# EAGLE design psu (EAGLE 7.4.0)
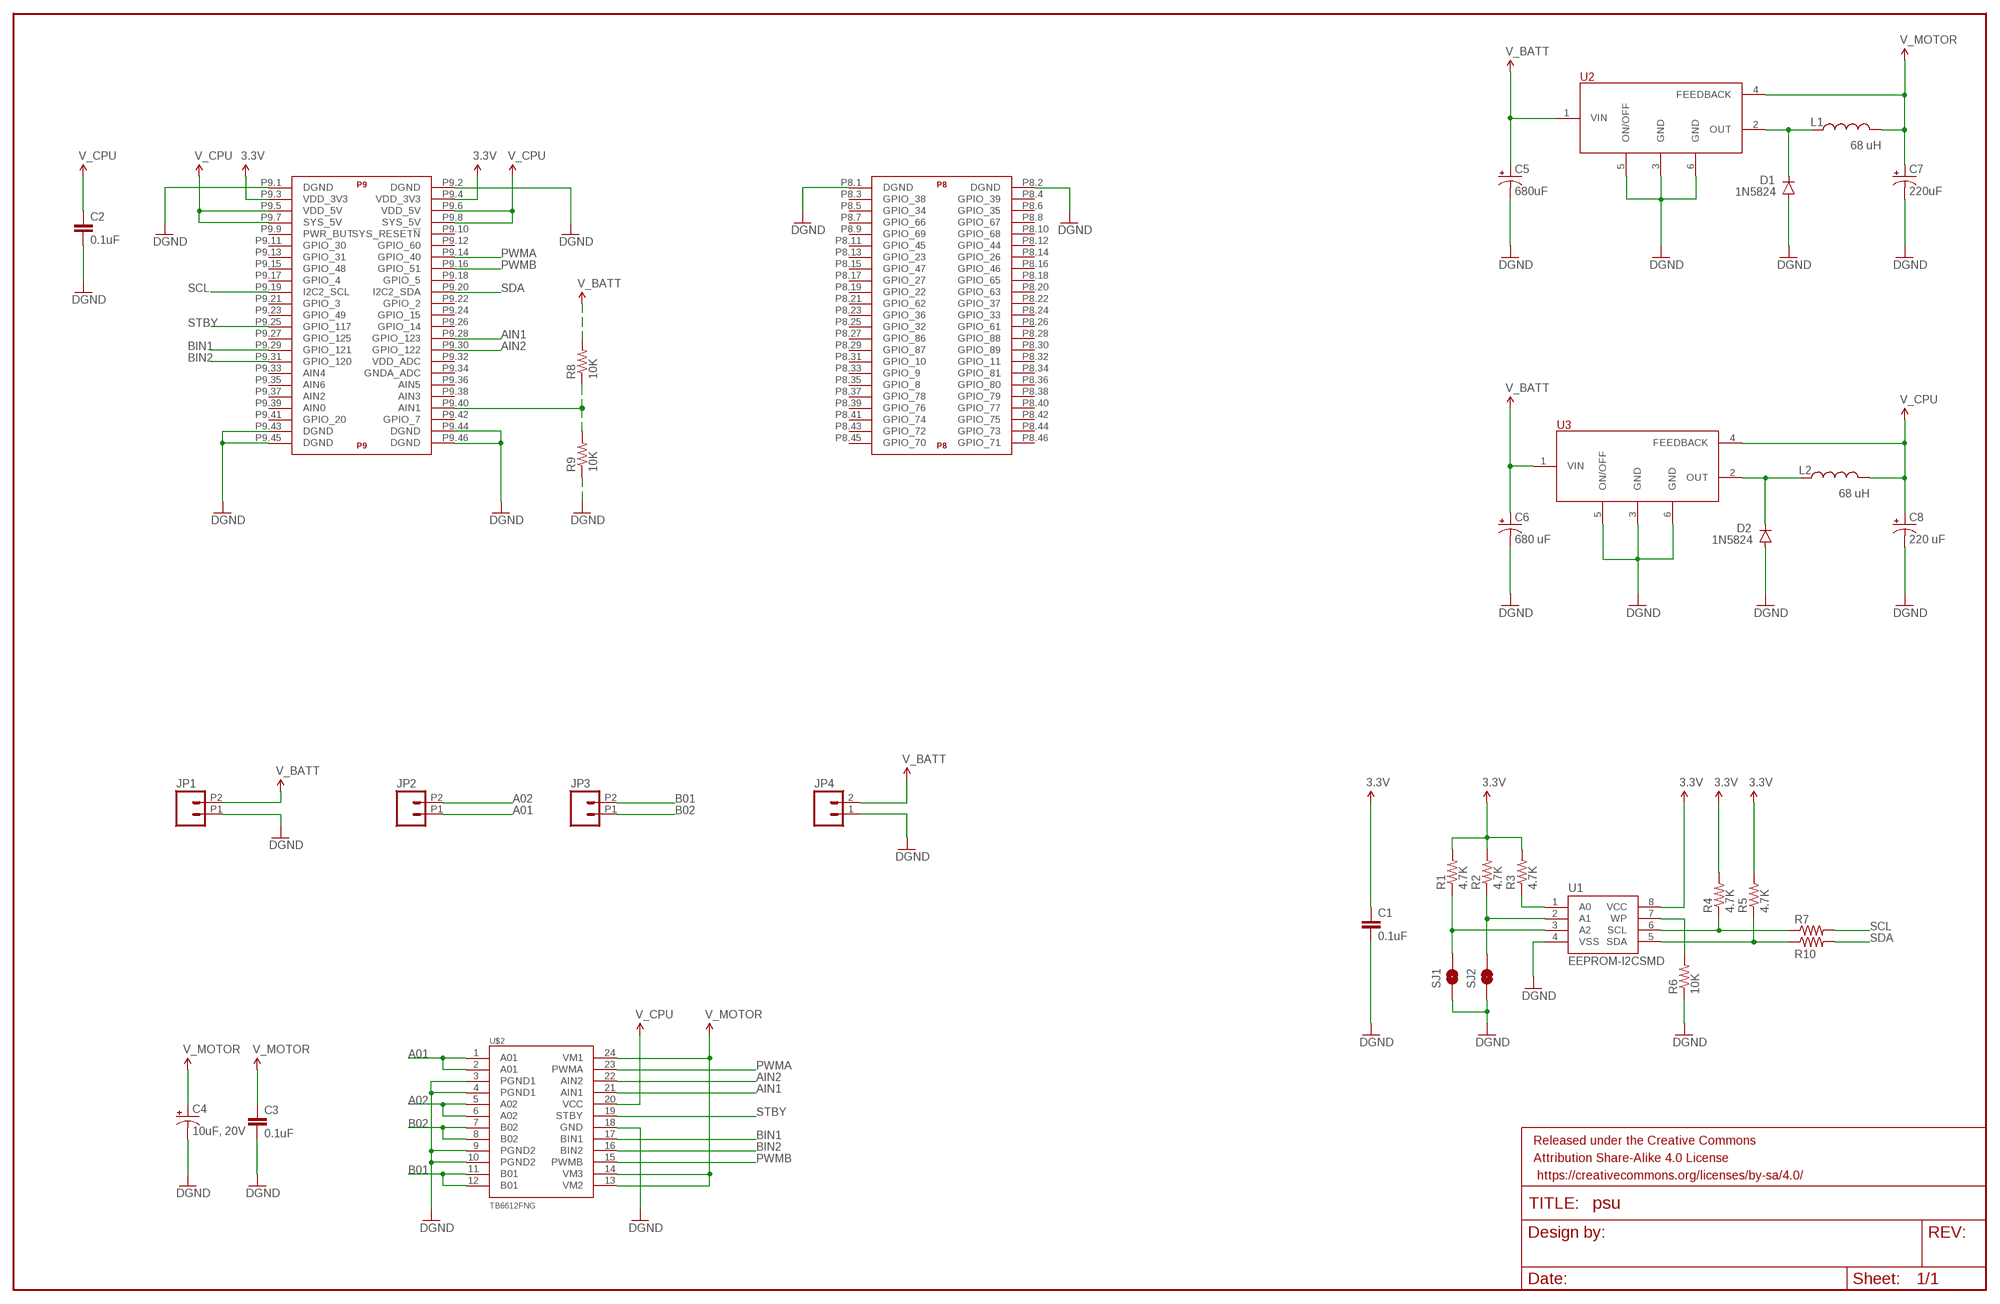
[diagram p0: schematic, sheet 1]

## Parts
C1  0.1uF  0.1UF-25V(+80/-20%)(0603)  [0603-CAP]
C2  0.1uF  0.1UF-25V(+80/-20%)(0603)  [0603-CAP]
C3  0.1uF  0.1UF-25V(+80/-20%)(0603)  [0603-CAP]
C4  10uF, 20V  10UF-25V-20%(PTH)KIT  [CPOL-RADIAL-10UF-25V-KIT]
C5  680uF  CAP_POLPTH2  [CPOL-RADIAL-10UF-25V]
C6  680 uF  CAP_POLPTH2  [CPOL-RADIAL-10UF-25V]
C7  220uF  CAP_POLPTH2  [CPOL-RADIAL-10UF-25V]
C8  220 uF  CAP_POLPTH2  [CPOL-RADIAL-10UF-25V]
D1  1N5824  DIODEPTH  [DIODE-1N4001]
D2  1N5824  DIODEPTH  [DIODE-1N4001]
FRAME2  FRAME-LEDGER  [CREATIVE_COMMONS]
JP1  M022.54MM_SCREWTERM  [1X02_2.54_SCREWTERM]
JP2  M022.54MM_SCREWTERM  [1X02_2.54_SCREWTERM]
JP3  M022.54MM_SCREWTERM  [1X02_2.54_SCREWTERM]
JP4  M023.5MM  [SCREWTERMINAL-3.5MM-2]
L1  68 uH  INDUCTOR0603  [0603]
L2  68 uH  INDUCTOR0603  [0603]
R1  4.7K  4.7KOHM-1/10W-1%(0603)  [0603-RES]
R2  4.7K  4.7KOHM-1/10W-1%(0603)  [0603-RES]
R3  4.7K  4.7KOHM-1/10W-1%(0603)  [0603-RES]
R4  4.7K  4.7KOHM-1/10W-1%(0603)  [0603-RES]
R5  4.7K  4.7KOHM-1/10W-1%(0603)  [0603-RES]
R6  10K  10KOHM-1/10W-1%(0603)0603  [0603-RES]
R7  0  RESISTOR0603  [0603-RES]
R8  10K  10KOHM-1/10W-1%(0603)0603  [0603-RES]
R9  10K  10KOHM-1/10W-1%(0603)0603  [0603-RES]
R10  0  RESISTOR0603  [0603-RES]
SJ1  JUMPER-PAD-2-NO  [PAD-JUMPER-2-NO_NO_SILK]
SJ2  JUMPER-PAD-2-NO  [PAD-JUMPER-2-NO_NO_SILK]
U1  EEPROM-I2CSMD  [SO08]
U2  LM2596  [TO-263]
U3  LM2596  [TO-263]
U$1  BEAGLE_BONE_BLACK_CAPE  [BEAGLE_BONE_BLACK_CAPE]
U$2  TB6612FNG  [SSOP24]

## Nets
3.3V: C1.1 R1.2 R2.2 R3.2 R4.2 R5.2 U1.8(VCC) U$1.P9.3(P9:VDD_3V3) U$1.P9.4(P9:VDD_3V3)
A01: JP2.P1 U$2.1(A01) U$2.2(A01)
A02: JP2.P2 U$2.5(A02) U$2.6(A02)
AIN1: U$1.P9.28(P9:GPIO_123) U$2.21(AIN1)
AIN2: U$1.P9.30(P9:GPIO_122) U$2.22(AIN2)
B01: JP3.P2 U$2.11(B01) U$2.12(B01)
B02: JP3.P1 U$2.7(B02) U$2.8(B02)
BIN1: U$1.P9.29(P9:GPIO_121) U$2.17(BIN1)
BIN2: U$1.P9.31(P9:GPIO_120) U$2.16(BIN2)
GND: C1.2 C2.2 C3.2 C4.2(-) C5.2(-) C6.2(-) C7.2(-) C8.2(-) D1.A D2.A JP1.P1 JP4.1 R6.1 R9.1 SJ1.1 SJ2.1 U1.4(VSS) U2.3(GND) U2.5(ON/OFF) U2.6(GND) U3.3(GND) U3.5(ON/OFF) U3.6(GND) U$1.P8.1(P8:DGND) U$1.P8.2(P8:DGND) U$1.P9.1(P9:DGND) U$1.P9.2(P9:DGND) U$1.P9.43(P9:DGND) U$1.P9.44(P9:DGND) U$1.P9.45(P9:DGND) U$1.P9.46(P9:DGND) U$2.3(PGND1) U$2.4(PGND1) U$2.9(PGND2) U$2.10(PGND2) U$2.18(GND) ; supply symbol labelled DGND
N$1: R3.1 U1.1(A0)
N$2: R2.1 SJ2.2 U1.2(A1)
N$3: R1.1 SJ1.2 U1.3(A2)
N$4: R8.1 R9.2 U$1.P9.40(P9:AIN1)
N$5: R6.2 U1.7(WP)
N$8: D1.C L1.1 U2.2(OUT)
N$9: D2.C L2.1 U3.2(OUT)
PWMA: U$1.P9.14(P9:GPIO_40) U$2.23(PWMA)
PWMB: U$1.P9.16(P9:GPIO_51) U$2.15(PWMB)
SCL: R7.2 U$1.P9.19(P9:I2C2_SCL)
SCL_PRE: R4.1 R7.1 U1.6(SCL)
SDA: R10.2 U$1.P9.20(P9:I2C2_SDA)
SDA_PRE: R5.1 R10.1 U1.5(SDA)
STBY: U$1.P9.25(P9:GPIO_117) U$2.19(STBY)
V_BATT: C5.1(+) C6.1(+) JP1.P2 JP4.2 R8.2 U2.1(VIN) U3.1(VIN)
V_CPU: C2.1 C8.1(+) L2.2 U3.4(FEEDBACK) U$1.P9.5(P9:VDD_5V) U$1.P9.6(P9:VDD_5V) U$1.P9.7(P9:SYS_5V) U$1.P9.8(P9:SYS_5V) U$2.20(VCC)
V_MOTOR: C3.1 C4.1(+) C7.1(+) L1.2 U2.4(FEEDBACK) U$2.13(VM2) U$2.14(VM3) U$2.24(VM1)
Unconnected: U$1.P8.3(P8:GPIO_38) U$1.P8.4(P8:GPIO_39) U$1.P8.5(P8:GPIO_34) U$1.P8.6(P8:GPIO_35) U$1.P8.7(P8:GPIO_66) U$1.P8.8(P8:GPIO_67) U$1.P8.9(P8:GPIO_69) U$1.P8.10(P8:GPIO_68) U$1.P8.11(P8:GPIO_45) U$1.P8.12(P8:GPIO_44) U$1.P8.13(P8:GPIO_23) U$1.P8.14(P8:GPIO_26) U$1.P8.15(P8:GPIO_47) U$1.P8.16(P8:GPIO_46) U$1.P8.17(P8:GPIO_27) U$1.P8.18(P8:GPIO_65) U$1.P8.19(P8:GPIO_22) U$1.P8.20(P8:GPIO_63) U$1.P8.21(P8:GPIO_62) U$1.P8.22(P8:GPIO_37) U$1.P8.23(P8:GPIO_36) U$1.P8.24(P8:GPIO_33) U$1.P8.25(P8:GPIO_32) U$1.P8.26(P8:GPIO_61) U$1.P8.27(P8:GPIO_86) U$1.P8.28(P8:GPIO_88) U$1.P8.29(P8:GPIO_87) U$1.P8.30(P8:GPIO_89) U$1.P8.31(P8:GPIO_10) U$1.P8.32(P8:GPIO_11) U$1.P8.33(P8:GPIO_9) U$1.P8.34(P8:GPIO_81) U$1.P8.35(P8:GPIO_8) U$1.P8.36(P8:GPIO_80) U$1.P8.37(P8:GPIO_78) U$1.P8.38(P8:GPIO_79) U$1.P8.39(P8:GPIO_76) U$1.P8.40(P8:GPIO_77) U$1.P8.41(P8:GPIO_74) U$1.P8.42(P8:GPIO_75) U$1.P8.43(P8:GPIO_72) U$1.P8.44(P8:GPIO_73) U$1.P8.45(P8:GPIO_70) U$1.P8.46(P8:GPIO_71) U$1.P9.9(P9:PWR_BUT) U$1.P9.10(P9:SYS_RESET!N) U$1.P9.11(P9:GPIO_30) U$1.P9.12(P9:GPIO_60) U$1.P9.13(P9:GPIO_31) U$1.P9.15(P9:GPIO_48) U$1.P9.17(P9:GPIO_4) U$1.P9.18(P9:GPIO_5) U$1.P9.21(P9:GPIO_3) U$1.P9.22(P9:GPIO_2) U$1.P9.23(P9:GPIO_49) U$1.P9.24(P9:GPIO_15) U$1.P9.26(P9:GPIO_14) U$1.P9.27(P9:GPIO_125) U$1.P9.32(P9:VDD_ADC) U$1.P9.33(P9:AIN4) U$1.P9.34(P9:GNDA_ADC) U$1.P9.35(P9:AIN6) U$1.P9.36(P9:AIN5) U$1.P9.37(P9:AIN2) U$1.P9.38(P9:AIN3) U$1.P9.39(P9:AIN0) U$1.P9.41(P9:GPIO_20) U$1.P9.42(P9:GPIO_7)

## Library data of the parts
C1-C3 = SparkFun-Capacitors:0.1UF-25V(+80/-20%)(0603): CAP-00810 Ceramic Standard decoupling cap; PROD_ID: CAP-00810
C4 = SparkFun-Capacitors:10UF-25V-20%(PTH): CAP-08440; PROD_ID: CAP-08440
C5-C8 = SparkFun-Capacitors:CAP_POL: Capacitor Polarized These are standard SMD and PTH capacitors. Normally 10uF, 47uF, and 100uF in electrolytic and tantalum varieties. Always verify the external diameter of the through hole cap, it varies with capacity, voltage, and manufacturer. The EIA devices should be standard.
D1 D2 = SparkFun-DiscreteSemi:DIODE: Diode These are standard reverse protection diodes and small signal diodes. SMA package can handle up to about 1A. SOD-323 can handle about 200mA. What the SOD-323 package when ordering, there are some mfgs out there that are 5-pin packages.
FRAME2 = SparkFun-Aesthetics:FRAME-LEDGER: Schematic Frame Standard 11x14 US Ledger frame
JP1-JP3 = SparkFun-Connectors:M02: Standard 2-pin 0.1" header. Use with - straight break away headers ( PRT-00116) - right angle break away headers (PRT-00553) - swiss pins (PRT-00743) - machine pins (PRT-00117) - female headers (PRT-00115) Molex polarized connector foot print use with: PRT-08233 with associated crimp pins and housings. 2.54_SCREWTERM for use with PRT-10571. 3.5mm Screw Terminal footprints for PRT-08084 5mm Screw Terminal footprints for use with PRT-08432
JP4 = SparkFun-Connectors:M02: Standard 2-pin 0.1" header. Use with - straight break away headers ( PRT-00116) - right angle break away headers (PRT-00553) - swiss pins (PRT-00743) - machine pins (PRT-00117) - female headers (PRT-00115) Molex polarized connector foot print use with: PRT-08233 with associated crimp pins and housings. 2.54_SCREWTERM for use with PRT-10571. 3.5mm Screw Terminal footprints for PRT-08084 5mm Screw Terminal footprints for use with PRT-08432; PROD_ID: CONN-08399
L1 L2 = SparkFun-Passives:INDUCTOR: Inductors Basic Inductor/Choke - 0603 and 1206. Footprints are not proven and vary greatly between part numbers. INDUCTOR POWER 3.3UH 4.0A SMD 0.197" L x 0.197" W x 0.177" H (5.00mm x 5.00mm x 4.50mm)
R1-R5 = SparkFun-Resistors:4.7KOHM-1/10W-1%(0603): RES-07857; PROD_ID: RES-07857
R6 R8 R9 = SparkFun-Resistors:10KOHM-1/10W-1%(0603): RES-00824; PROD_ID: RES-00824
R7 R10 = SparkFun-Resistors:RESISTOR: Resistor Basic schematic elements and footprints for 0603, 1206, and PTH resistors.
SJ1 SJ2 = SparkFun-Passives:JUMPER-PAD-2-NO
U1 = SparkFun-DigitalIC:EEPROM-I2C: I2C EEPROM chips, 24LC256 (and others)
U2 U3 = psu:LM2596: TI Buck converter
U$1 = SparkFun-Boards:BEAGLE_BONE_BLACK_CAPE
U$2 = SparkFun-PowerIC:TB6612FNG: Toshiba 1A dual motor driver IC-09363; PROD_ID: IC-09363

## Board
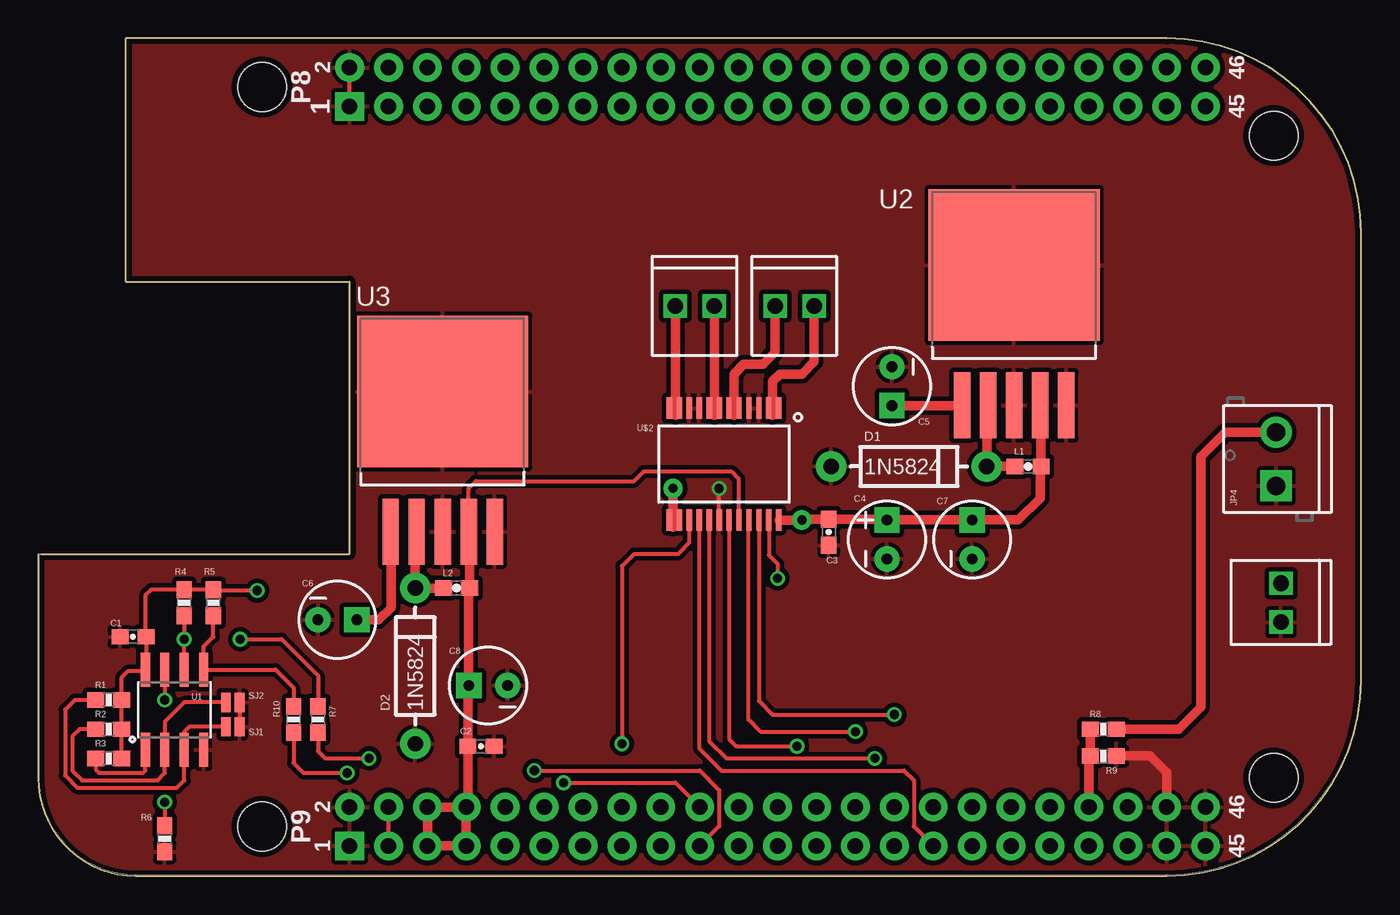
[diagram p1: board, top side]
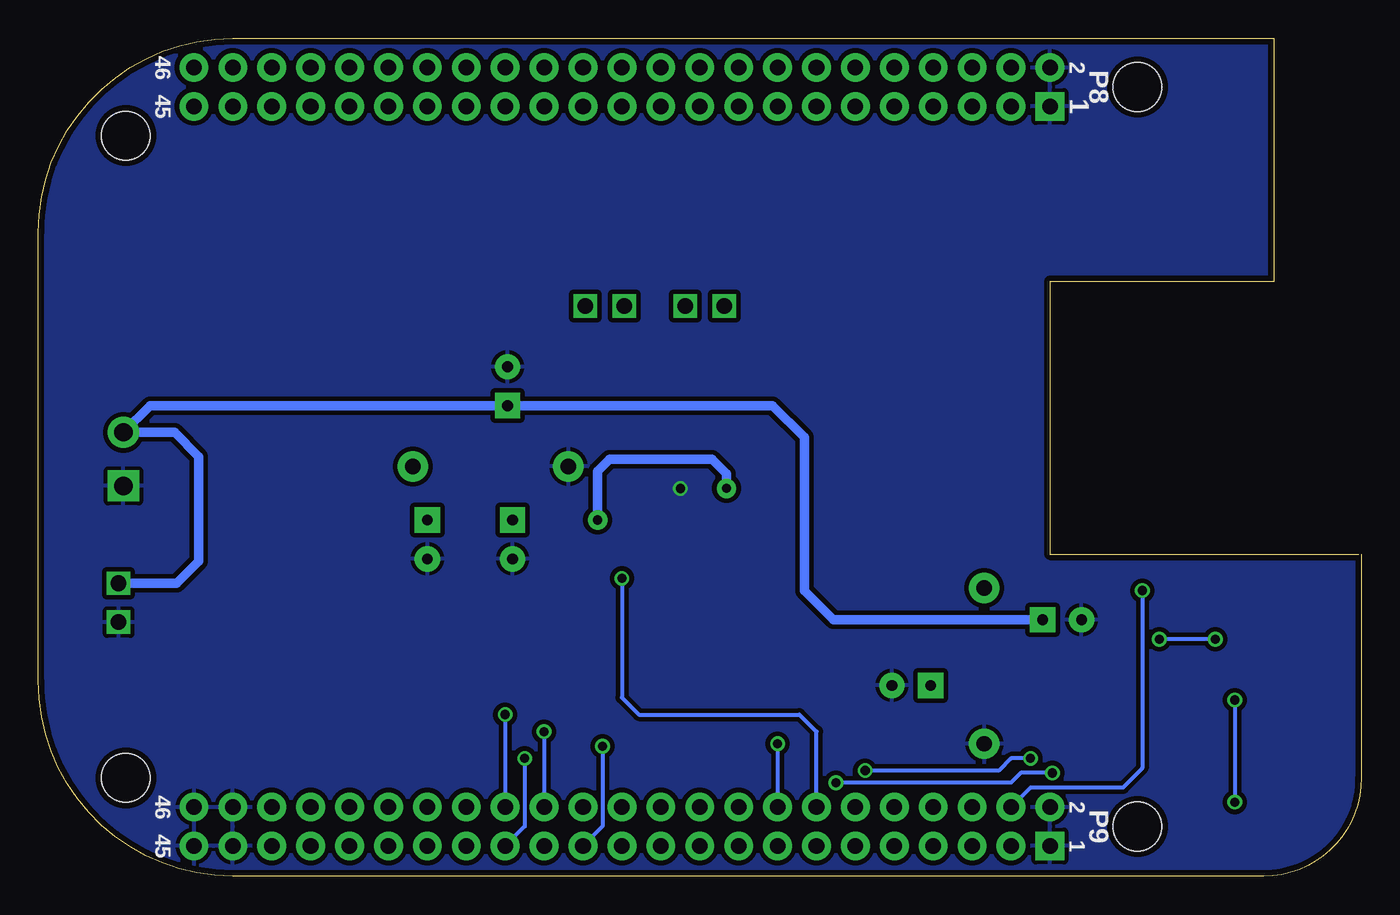
[diagram p2: board, bottom side, seen from below]

Size 86.36 x 54.69 mm. Coordinates in mm from the lower left corner, seen from the top.
Outline: 0,21.03 0,6.42 arc90 6.34,0 73.68,0 arc90 86.36,12.76 86.36,42 arc90 73.67,54.69 5.71,54.69 5.71,38.81 20.32,38.81 20.32,21.03 0.16,21.03
Copper layers (1*16): Top 0.0356mm / dielectric 1.5011mm / Bottom 0.0356mm
Design rules "LaenPCBOrder *": minimum track width 6mil, minimum drill 13mil, track to track 6mil, track to pad 6mil, pad to pad 6mil, via to via 6mil, smd to smd 6mil, copper to edge 15mil, drill to drill 6mil, minimum pad ring 7mil, minimum via ring 7mil, stop-mask expansion 3mil, vias tented up to drill 25mil, thermal gap 10mil

### Footprints (pad centres in the part's own frame; a part is rotated, then mirrored left to right if it is on the bottom)
0603-CAP = smd 1.1 x 1: 1 -0.85,0; 2 0.85,0
CPOL-RADIAL-10UF-25V-KIT = drill 0.7 pad 1.651 square: 1 1.27,0 | drill 0.7 pad 1.651: 2 -1.27,0
CPOL-RADIAL-10UF-25V = drill 0.7 pad 1.651 square: 1 1.27,0 | drill 0.7 pad 1.651: 2 -1.27,0
DIODE-1N4001 = drill 1 pad 1.981: A -5.08,0; C 5.08,0
1X02_2.54_SCREWTERM = drill 1.016 square: P1 2.54,0; P2 0,0
SCREWTERMINAL-3.5MM-2 = drill 1.2 pad 2.032 square: 1 0,0 | drill 1.2 pad 2.032: 2 3.5,0
0603 = smd 1.1 x 1: 1 -0.85,0; 2 0.85,0
0603-RES = smd 1.1 x 1: 1 -0.85,0; 2 0.85,0
PAD-JUMPER-2-NO_NO_SILK = smd 0.635 x 1.27: 1 -0.45,0; 2 0.45,0
SO08 = smd 0.61 x 2.21: 1 -1.905,-2.616; 2 -0.635,-2.616; 3 0.635,-2.616; 4 1.905,-2.616; 5 1.905,2.616; 6 0.635,2.616; 7 -0.635,2.616; 8 -1.905,2.616
TO-263 = smd 1.07 x 4.32: 1 2.2,-14.1; 2 3.9,-14.1; 3 5.6,-14.1; 4 7.3,-14.1; 5 9,-14.1 | smd 11.18 x 9.91: 6 5.6,-4.955
BEAGLE_BONE_BLACK_CAPE = drill 1.016 pad 1.88 square: P8.1 20.32,50.165; P9.1 20.32,1.905 | drill 1.016 pad 1.88: P8.2 20.32,52.705; P8.3 22.86,50.165; P8.4 22.86,52.705; P8.5 25.4,50.165; P8.6 25.4,52.705; P8.7 27.94,50.165; P8.8 27.94,52.705; P8.9 30.48,50.165; P8.10 30.48,52.705; P8.11 33.02,50.165; P8.12 33.02,52.705; P8.13 35.56,50.165; P8.14 35.56,52.705; P8.15 38.1,50.165; P8.16 38.1,52.705; P8.17 40.64,50.165; P8.18 40.64,52.705; P8.19 43.18,50.165; P8.20 43.18,52.705; P8.21 45.72,50.165; P8.22 45.72,52.705; P8.23 48.26,50.165; P8.24 48.26,52.705; P8.25 50.8,50.165; P8.26 50.8,52.705; P8.27 53.34,50.165; P8.28 53.34,52.705; P8.29 55.88,50.165; P8.30 55.88,52.705; P8.31 58.42,50.165; P8.32 58.42,52.705; P8.33 60.96,50.165; P8.34 60.96,52.705; P8.35 63.5,50.165; P8.36 63.5,52.705; P8.37 66.04,50.165; P8.38 66.04,52.705; P8.39 68.58,50.165; P8.40 68.58,52.705; P8.41 71.12,50.165; P8.42 71.12,52.705; P8.43 73.66,50.165; P8.44 73.66,52.705; P8.45 76.2,50.165; P8.46 76.2,52.705; P9.2 20.32,4.445; P9.3 22.86,1.905; P9.4 22.86,4.445; P9.5 25.4,1.905; P9.6 25.4,4.445; P9.7 27.94,1.905; P9.8 27.94,4.445; P9.9 30.48,1.905; P9.10 30.48,4.445; P9.11 33.02,1.905; P9.12 33.02,4.445; P9.13 35.56,1.905; P9.14 35.56,4.445; P9.15 38.1,1.905; P9.16 38.1,4.445; P9.17 40.64,1.905; P9.18 40.64,4.445; P9.19 43.18,1.905; P9.20 43.18,4.445; P9.21 45.72,1.905; P9.22 45.72,4.445; P9.23 48.26,1.905; P9.24 48.26,4.445; P9.25 50.8,1.905; P9.26 50.8,4.445; P9.27 53.34,1.905; P9.28 53.34,4.445; P9.29 55.88,1.905; P9.30 55.88,4.445; P9.31 58.42,1.905; P9.32 58.42,4.445; P9.33 60.96,1.905; P9.34 60.96,4.445; P9.35 63.5,1.905; P9.36 63.5,4.445; P9.37 66.04,1.905; P9.38 66.04,4.445; P9.39 68.58,1.905; P9.40 68.58,4.445; P9.41 71.12,1.905; P9.42 71.12,4.445; P9.43 73.66,1.905; P9.44 73.66,4.445; P9.45 76.2,1.905; P9.46 76.2,4.445 | hole 3.175: 14.605,3.175; 80.645,6.35; 80.645,48.26; 14.605,51.435
SSOP24 = smd 0.348 x 1.397: 1 -3.575,-3.656; 2 -2.925,-3.656; 3 -2.275,-3.656; 4 -1.625,-3.656; 5 -0.975,-3.656; 6 -0.325,-3.656; 7 0.325,-3.656; 8 0.975,-3.656; 9 1.625,-3.656; 10 2.275,-3.656; 11 2.925,-3.656; 12 3.575,-3.656; 13 3.575,3.656; 14 2.925,3.656; 15 2.275,3.656; 16 1.625,3.656; 17 0.975,3.656; 18 0.325,3.656; 19 -0.325,3.656; 20 -0.975,3.656; 21 -1.625,3.656; 22 -2.275,3.656; 23 -2.925,3.656; 24 -3.575,3.656

### Placement (x,y rotation side)
C1  6.19,15.64 180 top
C2  28.89,8.49 0 top
C3  51.59,22.46 270 top
C4  55.4,21.99 90 top
C5  55.72,31.99 270 top
C6  19.53,16.75 0 top
C7  60.96,21.99 90 top
C8  29.37,12.46 180 top
D1  56.83,26.75 0 top
D2  24.61,13.73 90 top
FRAME2  12.06,-28.65 0 top  (outside the outline)
JP1  81.12,19.13 270 top
JP2  48.1,37.23 0 top
JP3  41.59,37.23 0 top
JP4  80.8,25.48 90 top
L1  64.61,26.75 0 top
L2  27.3,18.81 0 top
R1  4.6,11.51 0 top
R2  4.6,9.6 0 top
R3  4.6,7.7 0 top
R4  9.53,17.86 90 top
R5  11.43,17.86 90 top
R6  8.26,2.46 90 top
R7  18.26,10.24 270 top
R8  69.53,9.6 0 top
R9  69.53,7.86 180 top
R10  16.67,10.24 270 top
SJ1  12.7,9.76 180 top
SJ2  12.7,11.35 180 top
U1  8.89,10.87 0 top
U2  58.1,44.85 0 top
U3  20.8,36.59 0 top
U$1  0,0.08 0 top
U$2  44.77,26.91 180 top

### Tracks (layer width: path | path; a pad name or v marks a point on that pad's centre or on a via)
3.3V  (via drill 0.6)
  Top 0.254: R3.2 R2.2 R1.2 5.45,12.99 5.87,13.41 6.91,13.41 U1.8 7.04,13.55 C1.1 6.99,15.69 6.99,18.34 7.36,18.71 R4.2 R5.2 11.49,18.65 v14.29,18.65 | U$1.P9.3 U$1.P9.4
  Bottom 0.254: v14.29,18.65 14.29,7.06 15.56,5.79 21.59,5.79 U$1.P9.4
A01
  Top 0.254: U$2.2 U$2.1 48.11,30.56 48.1,30.56 47.94,30.08
  Top 0.61: 47.94,30.08 47.94,32.31 48.42,32.78 49.85,32.78 50.64,33.58 JP2.P1
A02
  Top 0.254: 45.41,30.56 U$2.6 | U$2.5 45.41,30.56 | 45.41,30.56 45.4,30.08
  Top 0.61: 45.4,30.08 45.4,32.78 46.04,33.42 47.31,33.42 48.1,34.21 JP2.P2
AIN1  (via drill 0.6)
  Top 0.254: v53.34,9.45 47.15,9.45 46.35,10.24 46.35,23.21 U$2.21
  Bottom 0.254: v53.34,9.45 U$1.P9.28
AIN2  (via drill 0.6)
  Top 0.254: U$2.22 47.04,11.46 47.94,10.56 v55.88,10.56
  Bottom 0.254: v55.88,10.56 U$1.P9.30
B01
  Top 0.254: U$2.12 U$2.11 41.6,30.56 41.59,30.08
  Top 0.61: 41.59,30.08 JP3.P2
B02
  Top 0.254: U$2.8 U$2.7 44.29,30.56 44.13,30.08
  Top 0.61: 44.13,30.08 JP3.P1
BIN1  (via drill 0.6)
  Top 0.254: v54.61,7.7 44.93,7.7 43.79,8.83 U$2.17
  Bottom 0.254: v54.61,7.7 54.61,3.25 U$1.P9.29
BIN2
  Top 0.254: U$1.P9.31 57.15,3.25 57.15,6.27 56.52,6.91 44.61,6.91 43.14,8.37 U$2.16
GND  (via drill 0.6)
  Top 0.254: SJ2.1 SJ1.1 13.18,9.26 | U$1.P8.1 U$1.P8.2 | U$2.18 v44.44,25.31 44.45,25
  Top 0.61: R9.1 72.55,7.86 73.66,6.75 U$1.P9.44
  pour Bottom (isolate 0.305): 0,21.03 20.32,21.03 20.32,23.1 20.32,38.81 5.71,38.81 5.71,54.69 73.82,54.69 arc-90 86.36,42.15 86.36,12.78 arc-90 73.66,0.08 71.91,0.08 7.14,0.08 6.51,0.08 arc-90 0,6.59
  pour Top (isolate 0.305): 0,21.03 20.32,21.03 20.32,23.1 20.32,38.81 5.71,38.81 5.71,54.69 73.82,54.69 arc-90 86.36,42.15 86.36,12.78 arc-90 73.66,0.08 71.91,0.08 7.14,0.08 6.51,0.08 arc-90 0,6.59
N$1
  Top 0.254: R3.1 3.75,6.96 3.97,6.75 6.83,6.75 6.99,6.91 U1.1
N$2
  Top 0.254: R2.1 2.7,9.6 2.22,9.13 2.22,6.91 2.86,6.27 7.78,6.27 8.26,6.75 U1.2 8.26,10.08 9.53,11.35 SJ2.2
N$3
  Top 0.254: R1.1 2.38,11.51 1.75,10.87 1.75,6.59 2.54,5.79 9.05,5.79 9.53,6.27 U1.3 9.53,9.45 9.84,9.76 SJ1.2
N$4
  Top 0.254: 68.58,7.76 R9.2
  Top 0.61: U$1.P9.40 68.58,7.76 | R9.2 R8.1
N$5  (via drill 0.6 pad 0.61)
  Top 0.254: U1.7 v8.26,11.51 | v8.26,4.84 R6.2
  Bottom 0.254: v8.26,11.51 v8.26,4.84
N$8
  Top 0.61: L1.1 D1.C 61.91,30.66 U2.2
N$9
  Top 0.61: L2.1 D2.C 24.61,22.42 U3.2
PWMA  (via drill 0.6)
  Top 0.254: U$2.23 47.69,20.97 48.26,20.4 v48.26,19.45
  Bottom 0.254: U$1.P9.14 35.56,9.45 36.67,10.56 47.15,10.56 48.26,11.67 v48.26,19.45
PWMB  (via drill 0.6)
  Top 0.254: U$2.15 42.49,21.78 41.75,21.03 38.89,21.03 38.1,20.24 v38.1,8.65
  Bottom 0.254: v38.1,8.65 U$1.P9.16
SCL  (via drill 0.6 pad 0.3)
  Top 0.254: R7.2 18.26,8.18 18.73,7.7 v21.59,7.7 | v32.38,6.91 43.18,6.91 44.45,5.64 44.45,3.25 U$1.P9.19
  Bottom 0.254: v21.59,7.7 22.86,7.7 23.65,6.91 v32.38,6.91
SCL_PRE  (via drill 0.6 pad 0.3)
  Top 0.254: U1.6 v9.53,15.48 R4.1 | v13.18,15.48 15.88,15.48 18.26,13.1 R7.1
  Bottom 0.254: v9.53,15.48 v13.18,15.48
SDA  (via drill 0.6 pad 0.3)
  Top 0.254: R10.2 16.67,7.38 17.3,6.75 v20.16,6.75 | v34.29,6.11 41.59,6.11 U$1.P9.20
  Bottom 0.254: v20.16,6.75 22.23,6.75 22.86,6.11 v34.29,6.11
SDA_PRE
  Top 0.254: R5.1 11.43,15.64 10.79,15 U1.5 15.48,13.49 16.67,12.3 R10.1
STBY  (via drill 0.6)
  Top 0.254: U$2.19 45.09,8.96 45.56,8.49 v49.53,8.49
  Bottom 0.254: v49.53,8.49 49.53,3.25 U$1.P9.25
V_BATT
  Top 0.61: C5.1 60.27,30.72 U2.1 | R8.2 74.45,9.6 75.88,11.03 75.88,27.38 77.48,28.98 JP4.2 | 23.02,22.51 U3.1 23.02,22.47 23.02,17.54 22.23,16.75 C6.1
  Bottom 0.61: C6.1 34.45,16.75 36.35,18.65 36.35,28.65 38.42,30.72 C5.1 79.06,30.72 JP4.2 77.47,28.98 75.88,27.39 75.88,20.56 77.31,19.13 JP1.P2
V_CPU
  Top 0.254: U3.4 28.1,25.32 28.57,25.8 38.89,25.8 39.53,26.43 45.24,26.43 45.72,25.96 45.72,23.27 U$2.20
  Top 0.61: U$1.P9.8 U$1.P9.6 U$1.P9.5 U$1.P9.7 U$1.P9.8 | U3.4 28.16,22.07 L2.2 28.1,18.76 C8.1 28.04,12.41 C2.1 28.04,4.63 U$1.P9.8
V_MOTOR  (via drill 0.6 pad 1.27)
  Top 0.254: 41.28,23.25 U$2.13 | 41.44,22.78 41.28,23.25 | 41.28,23.25 41.27,23.26 U$2.14 | v49.84,23.25 v49.85,23.26
  Top 0.61: v49.85,23.26 49.9,23.31 C3.1 55.35,23.31 C4.1 C7.1 63.98,23.26 65.41,24.69 65.41,26.69 L1.2 65.46,30.69 U2.4 | 41.44,22.78 41.43,23.42 v41.43,25.32 | U$2.24 v49.84,23.25
  Bottom 0.61: v41.43,25.32 41.43,26.27 42.39,27.23 49.05,27.23 49.85,26.43 v49.85,23.26